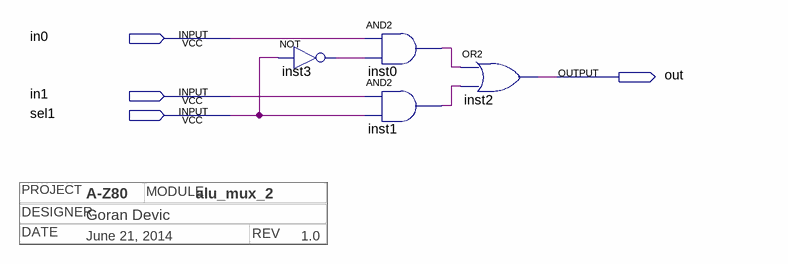
[diagram p0: schematic sheet]
// Quartus schematic alu_mux_2.bdf as structural Verilog: 4 symbols, 4 pins
// Title block: DATE: June 21, 2014; DESIGNER: Goran Devic; MODULE: alu_mux_2; PROJECT: A-Z80; REV: 1.0
module alu_mux_2 (
  input  in0,
  input  in1,
  input  sel1,
  output out
);

  wire inst0_out, inst1_out, inst3_out;

  not inst3 (inst3_out, sel1);
  and inst0 (inst0_out, in0, inst3_out);
  and inst1 (inst1_out, in1, sel1);
  or inst2 (out, inst0_out, inst1_out);
endmodule
